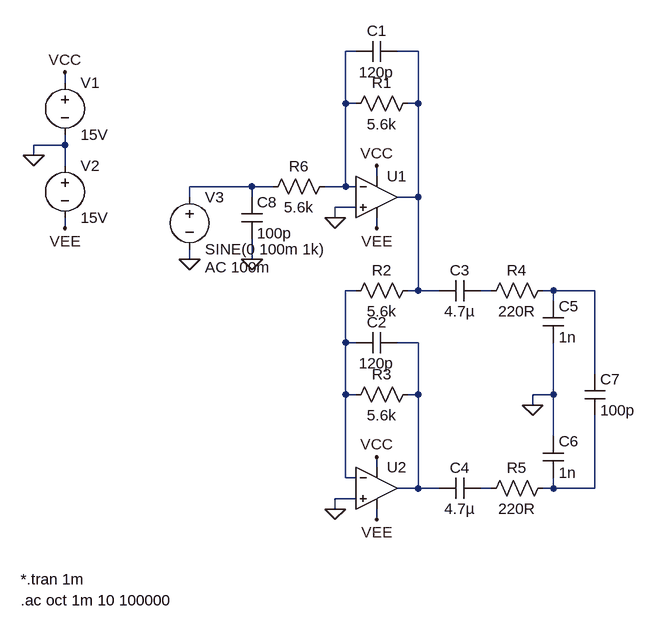
[diagram p0: schematic Inbuffer.asc]
Inbuffer.asc, the LTspice schematic file:
Version 4
SHEET 1 880 796
WIRE 176 -64 160 -64
WIRE 272 -64 240 -64
WIRE -272 -16 -272 -32
WIRE 160 16 160 -64
WIRE 176 16 160 16
WIRE 272 16 272 -64
WIRE 272 16 256 16
WIRE -272 80 -272 64
WIRE -272 80 -320 80
WIRE -320 96 -320 80
WIRE -272 112 -272 80
WIRE 208 128 208 112
WIRE 16 144 -80 144
WIRE 48 144 16 144
WIRE 160 144 160 16
WIRE 160 144 128 144
WIRE 176 144 160 144
WIRE -80 160 -80 144
WIRE 16 160 16 144
WIRE 272 160 272 16
WIRE 272 160 240 160
WIRE 176 176 144 176
WIRE 144 192 144 176
WIRE -272 208 -272 192
WIRE 208 208 208 192
WIRE -80 256 -80 240
WIRE 16 256 16 224
WIRE 176 304 160 304
WIRE 272 304 272 160
WIRE 272 304 256 304
WIRE 304 304 272 304
WIRE 384 304 368 304
WIRE 480 304 464 304
WIRE 544 304 480 304
WIRE 480 320 480 304
WIRE 160 384 160 304
WIRE 176 384 160 384
WIRE 272 384 240 384
WIRE 544 432 544 304
WIRE 160 464 160 384
WIRE 176 464 160 464
WIRE 272 464 272 384
WIRE 272 464 256 464
WIRE 480 464 480 384
WIRE 480 464 448 464
WIRE 448 480 448 464
WIRE 480 528 480 464
WIRE 208 576 208 560
WIRE 160 592 160 464
WIRE 176 592 160 592
WIRE 272 608 272 464
WIRE 272 608 240 608
WIRE 304 608 272 608
WIRE 384 608 368 608
WIRE 480 608 480 592
WIRE 480 608 464 608
WIRE 544 608 544 496
WIRE 544 608 480 608
WIRE 176 624 144 624
WIRE 144 640 144 624
WIRE 208 656 208 640
FLAG -272 -32 VCC
FLAG -272 208 VEE
FLAG -320 96 0
FLAG 208 112 VCC
FLAG 208 208 VEE
FLAG 208 560 VCC
FLAG 208 656 VEE
FLAG 144 192 0
FLAG 144 640 0
FLAG 16 256 0
FLAG -80 256 0
FLAG 448 480 0
SYMBOL Opamps\\UniversalOpamp2 208 160 R0
SYMATTR InstName U1
SYMBOL voltage -272 -32 R0
WINDOW 123 0 0 Left 0
WINDOW 39 0 0 Left 0
SYMATTR InstName V1
SYMATTR Value 15V
SYMBOL voltage -272 96 R0
WINDOW 123 0 0 Left 0
WINDOW 39 0 0 Left 0
SYMATTR InstName V2
SYMATTR Value 15V
SYMBOL res 272 0 R90
WINDOW 0 0 56 VBottom 2
WINDOW 3 32 56 VTop 2
SYMATTR InstName R1
SYMATTR Value 5.6k
SYMBOL cap 240 -80 R90
WINDOW 0 0 32 VBottom 2
WINDOW 3 32 32 VTop 2
SYMATTR InstName C1
SYMATTR Value 120p
SYMBOL res 272 288 R90
WINDOW 0 0 56 VBottom 2
WINDOW 3 32 56 VTop 2
SYMATTR InstName R2
SYMATTR Value 5.6k
SYMBOL res 272 448 R90
WINDOW 0 0 56 VBottom 2
WINDOW 3 32 56 VTop 2
SYMATTR InstName R3
SYMATTR Value 5.6k
SYMBOL cap 240 368 R90
WINDOW 0 0 32 VBottom 2
WINDOW 3 32 32 VTop 2
SYMATTR InstName C2
SYMATTR Value 120p
SYMBOL Opamps\\UniversalOpamp2 208 608 R0
SYMATTR InstName U2
SYMBOL cap 368 288 R90
WINDOW 0 0 32 VBottom 2
WINDOW 3 32 32 VTop 2
SYMATTR InstName C3
SYMATTR Value 4.7µ
SYMBOL cap 368 592 R90
WINDOW 0 0 32 VBottom 2
WINDOW 3 32 32 VTop 2
SYMATTR InstName C4
SYMATTR Value 4.7µ
SYMBOL res 480 288 R90
WINDOW 0 0 56 VBottom 2
WINDOW 3 32 56 VTop 2
SYMATTR InstName R4
SYMATTR Value 220R
SYMBOL res 480 592 R90
WINDOW 0 0 56 VBottom 2
WINDOW 3 32 56 VTop 2
SYMATTR InstName R5
SYMATTR Value 220R
SYMBOL cap 464 320 R0
SYMATTR InstName C5
SYMATTR Value 1n
SYMBOL cap 464 528 R0
SYMATTR InstName C6
SYMATTR Value 1n
SYMBOL cap 528 432 R0
SYMATTR InstName C7
SYMATTR Value 100p
SYMBOL res 144 128 R90
WINDOW 0 0 56 VBottom 2
WINDOW 3 32 56 VTop 2
SYMATTR InstName R6
SYMATTR Value 5.6k
SYMBOL cap 0 160 R0
SYMATTR InstName C8
SYMATTR Value 100p
SYMBOL voltage -80 144 R0
WINDOW 123 24 124 Left 2
WINDOW 39 0 0 Left 0
SYMATTR InstName V3
SYMATTR Value SINE(0 100m 1k)
SYMATTR Value2 AC 100m
TEXT -340 748 Left 2 !*.tran 1m
TEXT -340 780 Left 2 !.ac oct 1m 10 100000

The netlist it stands for:
* Inbuffer.asc
XU1 0 N001 VCC VEE N002 level.2 Avol=1Meg GBW=10Meg Slew=10Meg ilimit=25m rail=0 Vos=0 phimargin=45 en=0 enk=0 in=0 ink=0 Rin=500Meg  ; pins IN+ IN- V+ V- OUT
V1 VCC 0 15V
V2 0 VEE 15V
R1 N002 N001 5.6k
C1 N002 N001 120p
R2 N002 N004 5.6k
R3 N007 N004 5.6k
C2 N007 N004 120p
XU2 0 N004 VCC VEE N007 level.2 Avol=1Meg GBW=10Meg Slew=10Meg ilimit=25m rail=0 Vos=0 phimargin=45 en=0 enk=0 in=0 ink=0 Rin=500Meg  ; pins IN+ IN- V+ V- OUT
C3 N005 N002 4.7µ
C4 N008 N007 4.7µ
R4 N006 N005 220R
R5 N009 N008 220R
C5 N006 0 1n
C6 0 N009 1n
C7 N006 N009 100p
R6 N001 N003 5.6k
C8 N003 0 100p
V3 N003 0 SINE(0 100m 1k) AC 100m
*.tran 1m
.ac oct 1m 10 100000
.lib UniversalOpamps2.sub
.backanno
.end